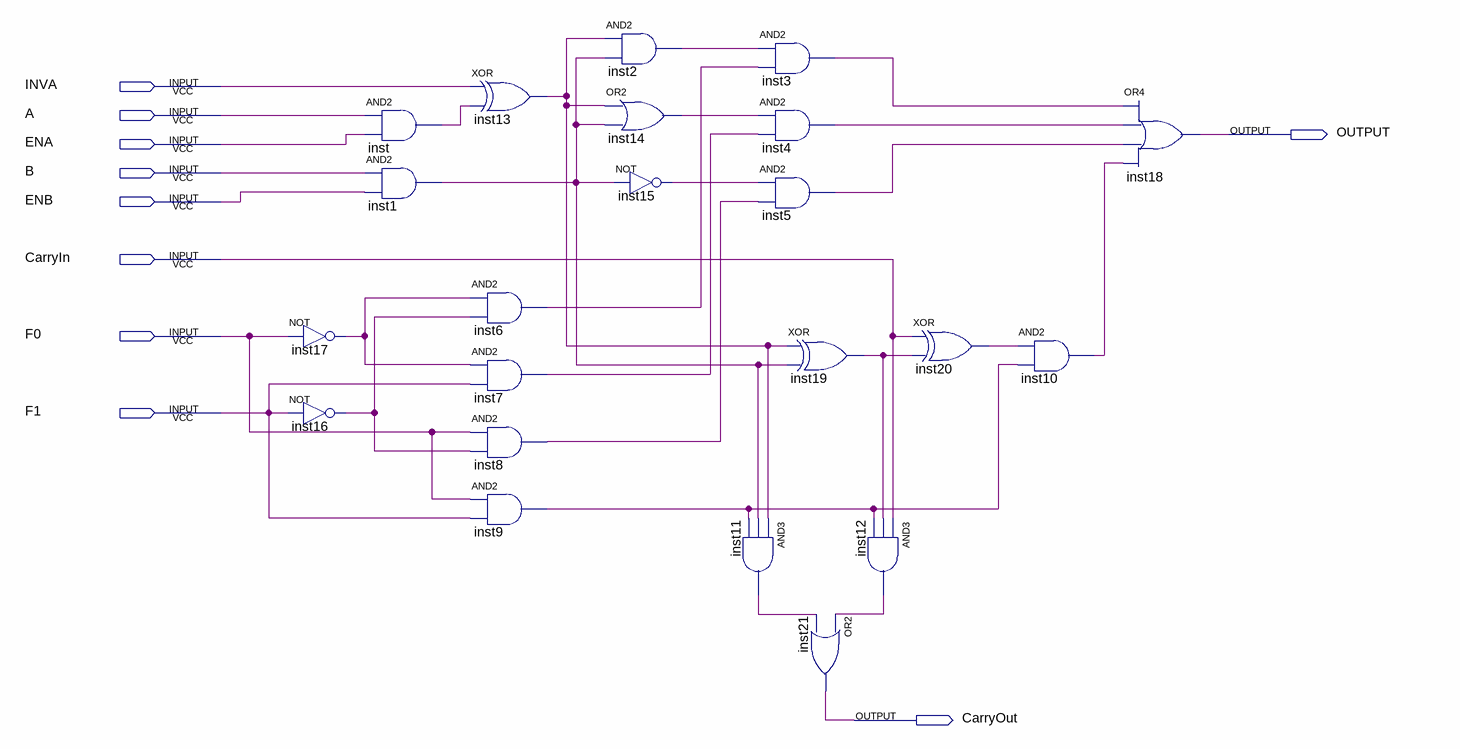
[diagram p0: schematic sheet]
// Quartus schematic ULA1bit.bdf as structural Verilog: 22 symbols, 10 pins
module ULA1bit (
  input  INVA,
  input  A,
  input  ENA,
  input  B,
  input  ENB,
  input  CarryIn,
  input  F0,
  input  F1,
  output OUTPUT,
  output CarryOut
);

  wire inst1_out, inst2_out, inst3_out, inst4_out, inst5_out, inst6_out, inst7_out, inst8_out, inst9_out,
       inst10_out, inst11_out, inst12_out, inst13_out, inst14_out, inst15_out, inst16_out, inst17_out,
       inst19_out, inst20_out, inst_out;

  not inst17 (inst17_out, F0);
  not inst16 (inst16_out, F1);
  and inst (inst_out, A, ENA);
  and inst1 (inst1_out, B, ENB);
  xor inst13 (inst13_out, INVA, inst_out);
  and inst6 (inst6_out, inst17_out, inst16_out);
  and inst7 (inst7_out, inst17_out, F1);
  and inst8 (inst8_out, F0, inst16_out);
  and inst9 (inst9_out, F0, F1);
  and inst2 (inst2_out, inst13_out, inst1_out);
  or inst14 (inst14_out, inst13_out, inst1_out);
  not inst15 (inst15_out, inst1_out);
  and inst3 (inst3_out, inst2_out, inst6_out);
  and inst4 (inst4_out, inst14_out, inst7_out);
  and inst5 (inst5_out, inst15_out, inst8_out);
  xor inst19 (inst19_out, inst13_out, inst1_out);
  and inst11 (inst11_out, inst13_out, inst1_out, inst9_out);
  or inst21 (CarryOut, inst12_out, inst11_out);
  and inst12 (inst12_out, CarryIn, inst19_out, inst9_out);
  xor inst20 (inst20_out, CarryIn, inst19_out);
  and inst10 (inst10_out, inst20_out, inst9_out);
  or inst18 (OUTPUT, inst3_out, inst4_out, inst5_out, inst10_out);
endmodule
